# Altium schematic sheet Sheet3.SchDoc
size A; SheetNumber: 1; SheetTotal: 1
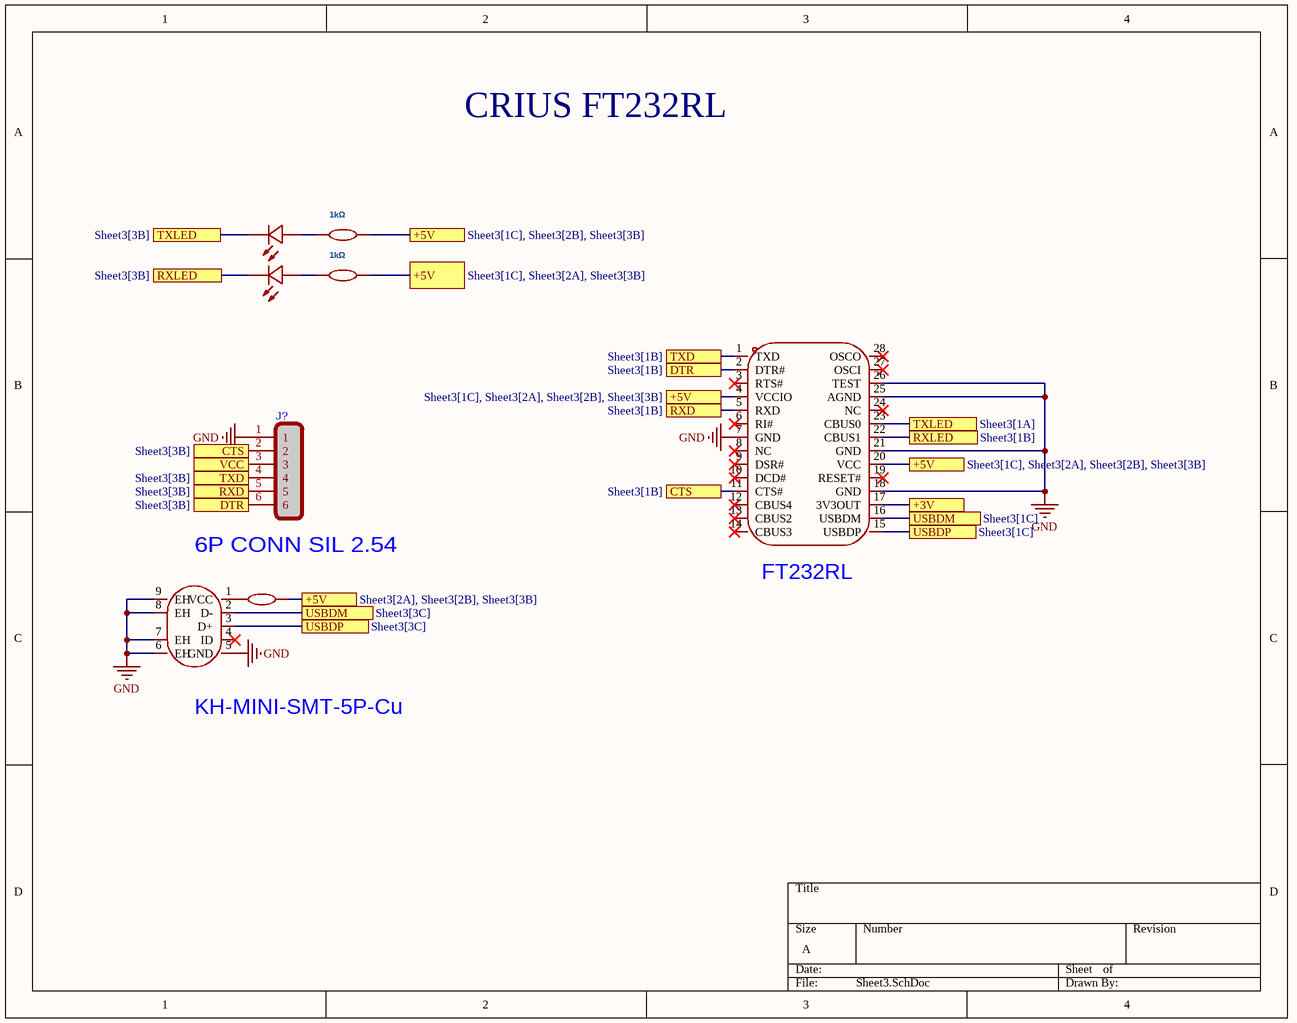
[diagram p0: Sheet3.SchDoc]

## Parts
J?  6P CONN SIL 2.54  [6P CONN SIL 2.54]
LED1  YLED0603R  [LED0603-FD]  (value not drawn)
LED2  YLED0603R  [LED0603-FD]  (value not drawn)
R1  1kΩ  [R0603]
R2  1kΩ  [R0603]
R?  2kΩ  [R0603]  (value not drawn)
U?  FT232RL  [SSOP-28_L10.2-W5.3-P0.65-LS7.8-BL]
USB?  KH-MINI-SMT-5P-Cu  [MINI-USB-SMD_KH-MINI-SMT-5P-CU]

## Ports
+3V, +5V (see Sheet3[1C], Sheet3[2A], Sheet3[2B], Sheet3[3B]), +5V (see Sheet3[1C], Sheet3[2A], Sheet3[3B]), +5V (see Sheet3[1C], Sheet3[2B], Sheet3[3B]), +5V (see Sheet3[2A], Sheet3[2B], Sheet3[3B]), CTS (see Sheet3[1B]), CTS (see Sheet3[3B]), DTR (see Sheet3[1B]), DTR (see Sheet3[3B]), RXD (see Sheet3[1B]), RXD (see Sheet3[3B]), RXLED (see Sheet3[1B]), RXLED (see Sheet3[3B]), TXD (see Sheet3[1B]), TXD (see Sheet3[3B]), TXLED (see Sheet3[1A]), TXLED (see Sheet3[3B]), USBDM (see Sheet3[1C]), USBDM (see Sheet3[3C]), USBDP (see Sheet3[1C]), USBDP (see Sheet3[3C]), VCC

## Nets
GND: J?.1 U?.7(GND) U?.18(GND) U?.21(GND) U?.25(AGND) U?.26(TEST) USB?.5(GND) USB?.6(EH) USB?.7(EH) USB?.8(EH) USB?.9(EH)
+3V: U?.17(3V3OUT) ; port +3V
+5V: R1.2 R2.2 R?.2 U?.4(VCCIO) U?.20(VCC) ; port +5V
CTS: J?.2 U?.11(CTS#) ; port CTS
DTR: J?.6 U?.2(DTR#) ; port DTR
RXD: J?.5 U?.5(RXD) ; port RXD
RXLED: LED2.2(-) U?.22(CBUS1) ; port RXLED
TXD: J?.4 U?.1(TXD) ; port TXD
TXLED: LED1.2(-) U?.23(CBUS0) ; port TXLED
USBDM: U?.16(USBDM) USB?.2(D-) ; port USBDM
USBDP: U?.15(USBDP) USB?.3(D+) ; port USBDP
VCC: J?.3 ; port VCC
NetLED1_1: LED1.1(+) R1.1
NetLED2_1: LED2.1(+) R2.1
NetR?_1: R?.1 USB?.1(VCC)

Not connected (* = marked no-connect by the designer): U? 3(RTS#)* 6(RI#)* 8(NC)* 9(DSR#)* 10(DCD#)* 12(CBUS4)* 13(CBUS2)* 14(CBUS3)* 19(RESET#)* 24(NC)* 27(OSCI)* 28(OSCO)*; USB? 4(ID)*

## Notes on the sheet
- CRIUS FT232RL

## Library data of the parts
LED1 LED2 = YLED0603R: Manufacturer: YONGYUTAI(永裕泰); Add into BOM: yes; Emitted Color: Red; Forward Voltage (VF): 1.8V~2.4V; Forward Current: 25mA; Dominant Wavelength: 620nm~625nm; Symbol: YLED0603R; Device: YLED0603R; LCSC Part Name: YLED0603R; Supplier Part: C19171390; Manufacturer Part: YLED0603R; Supplier Footprint: 0603; JLCPCB Part Class: Extended Part; Datasheet: https://atta.szlcsc.com/upload/public/pdf/source/20231027/FB19AF06E2C70028E58AB5CEDD1BDC72.pdf; Supplier: LCSC; Convert to PCB: yes; Power Dissipation: -; Peak Wavelength: -; Diode Configuration: -; Lens Color: -; Color Temperature: -; Luminous Intensity: -; Viewing Angle: -; Mounting Sytle: -; Operating Temperature: -40℃~+85℃
R1 R2 = 0603WAF2001T5E: Manufacturer: UNI-ROYAL(厚声); Add into BOM: yes; Value: 2kΩ; Tolerance: ±1%; Temperature Coefficient: ±100ppm/℃; Symbol: 0603WAF2001T5E; Device: 0603WAF2001T5E; LCSC Part Name: 2kΩ ±1% 100mW 厚膜电阻; Supplier Part: C22975; Manufacturer Part: 0603WAF2001T5E; Supplier Footprint: 0603; JLCPCB Part Class: Basic Part; Datasheet: https://atta.szlcsc.com/upload/public/pdf/source/20200306/C422600_1E6D84923E4A46A82E41ADD87F860B5C.pdf; Supplier: LCSC; Convert to PCB: yes; Type: Thick Film Resistors; Operating Temperature Range: -55℃~+155℃
R? = 0603WAF2001T5E: Manufacturer: UNI-ROYAL(厚声); Add into BOM: yes; Tolerance: ±1%; Temperature Coefficient: ±100ppm/℃; Symbol: 0603WAF2001T5E; Device: 0603WAF2001T5E; LCSC Part Name: 2kΩ ±1% 100mW 厚膜电阻; Supplier Part: C22975; Manufacturer Part: 0603WAF2001T5E; Supplier Footprint: 0603; JLCPCB Part Class: Basic Part; Datasheet: https://atta.szlcsc.com/upload/public/pdf/source/20200306/C422600_1E6D84923E4A46A82E41ADD87F860B5C.pdf; Supplier: LCSC; Convert to PCB: yes; Type: Thick Film Resistors; Value: 2kΩ; Operating Temperature Range: -55℃~+155℃
U? = FT232RL: Manufacturer: FTDI(飞特帝亚); Add into BOM: yes; Applications Function: USB to UART; Protocol: USB 2.0; Voltage - Supply: 4V~5.25V；3.3V~5.25V; Symbol: FT232RL; Device: FT232RL; LCSC Part Name: FT232R USB UART IC; Supplier Part: C490691; Manufacturer Part: FT232RL; Supplier Footprint: SSOP-28-208mil; JLCPCB Part Class: Extended Part; Datasheet: https://atta.szlcsc.com/upload/public/pdf/source/20200318/C490691_690E4DF63E1AFF9F26AE376DE8985AE3.pdf; Supplier: LCSC; Convert to PCB: yes; Number of Channels: -; Data Rate: -; Operating Temperature: -40℃~+85℃
USB? = KH-MINI-SMT-5P-Cu: Manufacturer: kinghelm(金航标); Add into BOM: yes; Connector Type: Mini-B; Gender: Female; Number of Ports: 1; Number of Contacts: 5P; Current Rating - Power (Max): 1A; Symbol: KH-MINI-SMT-5P-CU; Device: KH-MINI-SMT-5P-Cu; LCSC Part Name: Mini-B 母 卧贴; Supplier Part: C2688795; Manufacturer Part: KH-MINI-SMT-5P-Cu; Supplier Footprint: SMD; JLCPCB Part Class: Extended Part; Datasheet: https://atta.szlcsc.com/upload/public/pdf/source/20210202/C2688795_BF0BB16DAD2ABFC9845DEEA6AC1A1F9C.pdf; Supplier: LCSC; Convert to PCB: yes; Standard: USB 2.0; Mounting Style: 卧贴; Contact Material: -; Contact Plating: -; Operating Temperature Range: -; Soldering Temperature(Max): -